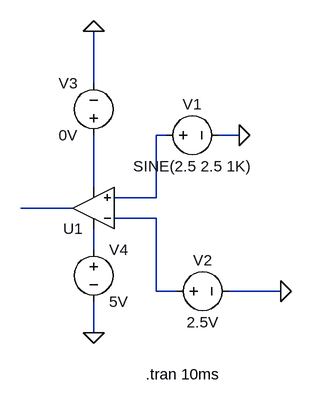
[diagram p0: schematic partB_ADC.asc]
partB_ADC.asc, the LTspice schematic file:
Version 4.1
SHEET 1 880 680
WIRE 176 -48 176 -128
WIRE 288 32 272 32
WIRE 400 32 368 32
WIRE 176 112 176 32
WIRE 272 128 272 32
WIRE 272 128 208 128
WIRE 144 144 64 144
WIRE 272 160 208 160
WIRE 176 208 176 176
WIRE 272 272 272 160
WIRE 304 272 272 272
WIRE 464 272 384 272
WIRE 176 336 176 288
FLAG 400 32 0
FLAG 464 272 0
FLAG 176 -128 0
FLAG 176 336 0
SYMBOL voltage 272 32 R270
WINDOW 0 32 56 VTop 2
WINDOW 3 -32 56 VBottom 2
WINDOW 123 0 0 Left 0
WINDOW 39 0 0 Left 0
SYMATTR InstName V1
SYMATTR Value SINE(2.5 2.5 1K)
SYMBOL voltage 288 272 R270
WINDOW 0 32 56 VTop 2
WINDOW 3 -32 56 VBottom 2
WINDOW 123 0 0 Left 0
WINDOW 39 0 0 Left 0
SYMATTR InstName V2
SYMATTR Value 2.5V
SYMBOL voltage 176 48 R180
WINDOW 0 24 96 Left 2
WINDOW 3 24 16 Left 2
SYMATTR InstName V3
SYMATTR Value 0V
SYMBOL voltage 176 192 R0
SYMATTR InstName V4
SYMATTR Value 5V
SYMBOL OpAmps\\UniversalOpAmp2 176 144 R180
SYMATTR InstName U1
TEXT 256 400 Left 2 !.tran 10ms

The netlist it stands for:
* partB_ADC.asc
V1 N001 0 SINE(2.5 2.5 1K)
V2 N004 0 2.5V
V3 N002 0 0V
V4 N005 0 5V
X§U1 N001 N004 N005 N002 N003 level2 Avol=1Meg GBW=10Meg Slew=10Meg Ilimit=25m Rail=0 Vos=0 En=0 Enk=0 In=0 Ink=0 Rin=500Meg  ; pins In+ In- V+ V- OUT
.tran 10ms
.lib UniversalOpAmp2.lib
.backanno
.end